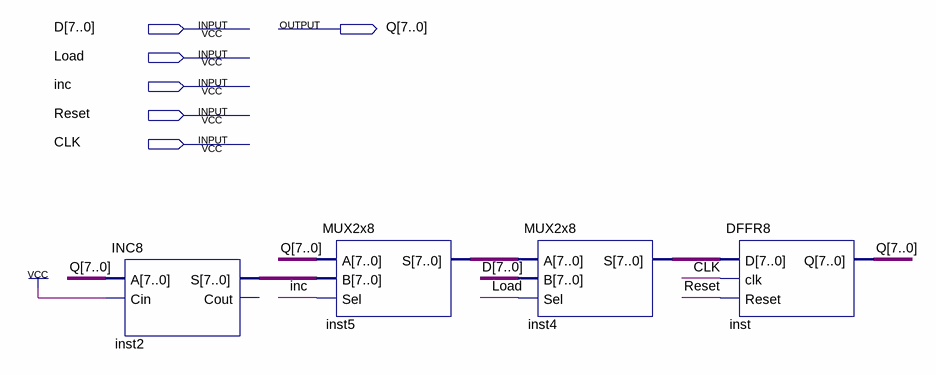
[diagram p0: schematic sheet]
// Quartus schematic PC.bdf as structural Verilog: 4 symbols, 6 pins
module PC (
  input  [7:0] D,
  input  Load,
  input  inc,
  input  Reset,
  input  CLK,
  output [7:0] Q
);

  wire [7:0] inst2_s, inst4_s, inst5_s;

  INC8 inst2 (.A(Q), .Cin(1'b1), .S(inst2_s));  // open: Cout
  MUX2x8 inst5 (.A(Q), .B(inst2_s), .Sel(inc), .S(inst5_s));
  MUX2x8 inst4 (.A(inst5_s), .B(D), .Sel(Load), .S(inst4_s));
  DFFR8 inst (.D(inst4_s), .clk(CLK), .Reset(Reset), .Q(Q));
endmodule
